# EAGLE design Cab_Board (EAGLE 9.6.2)
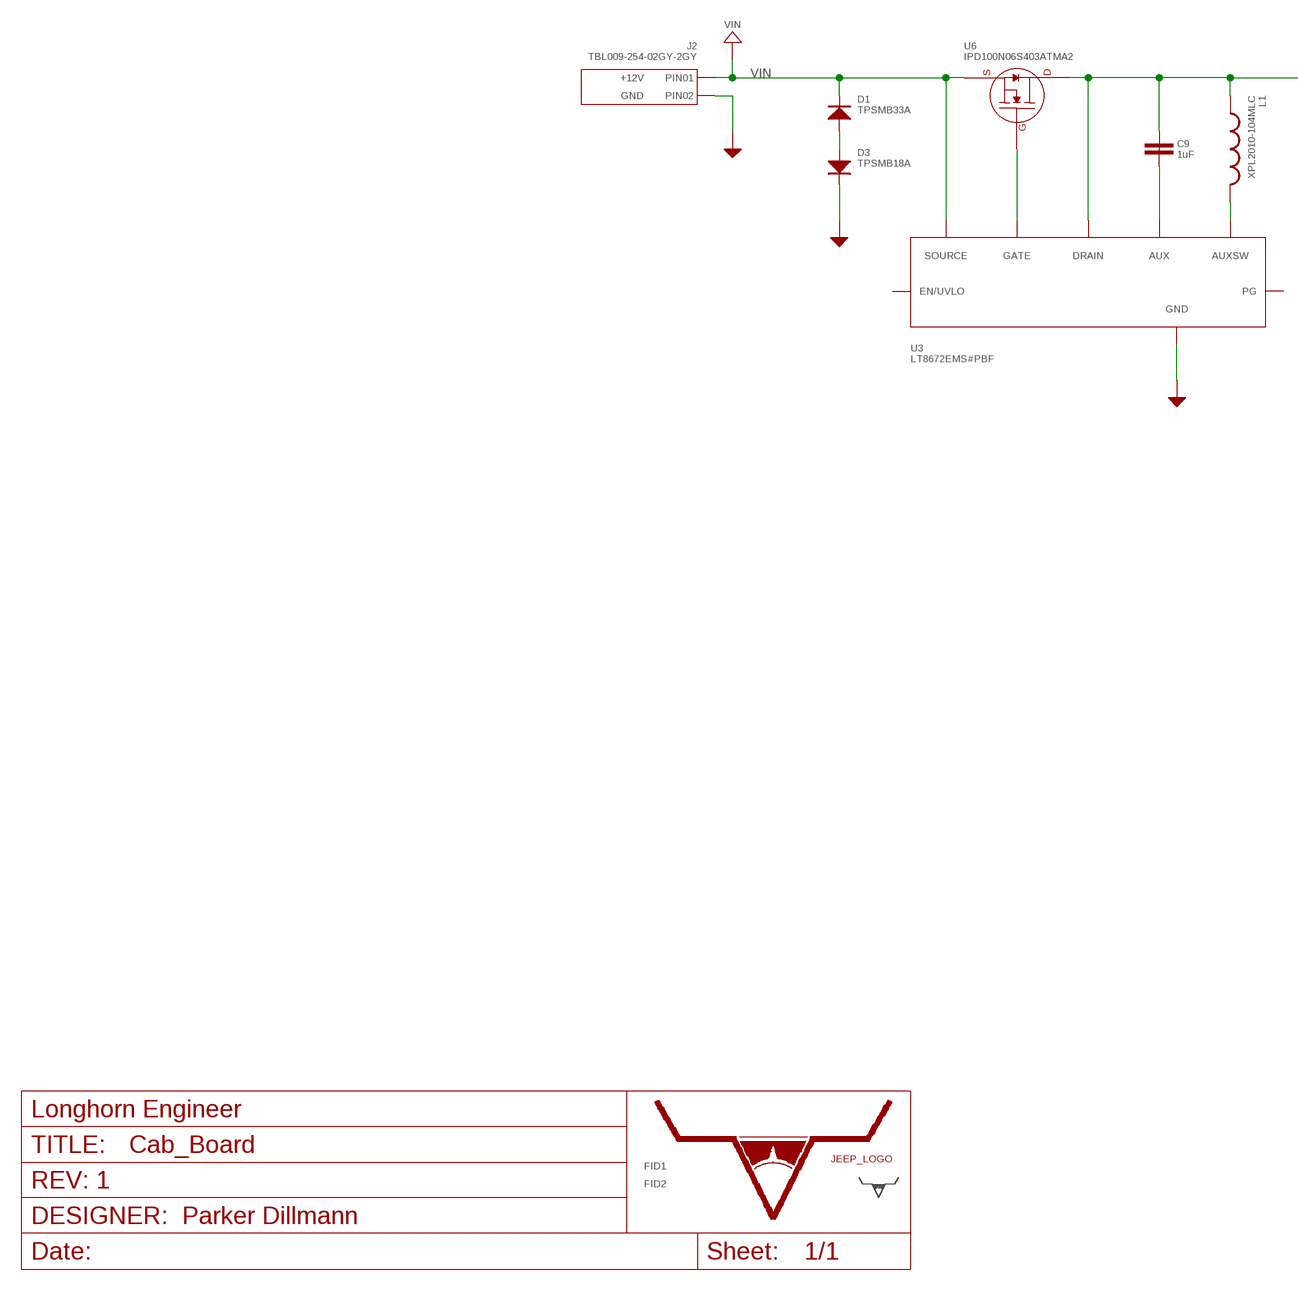
[diagram p0: schematic, sheet 1, part 1 of 3]
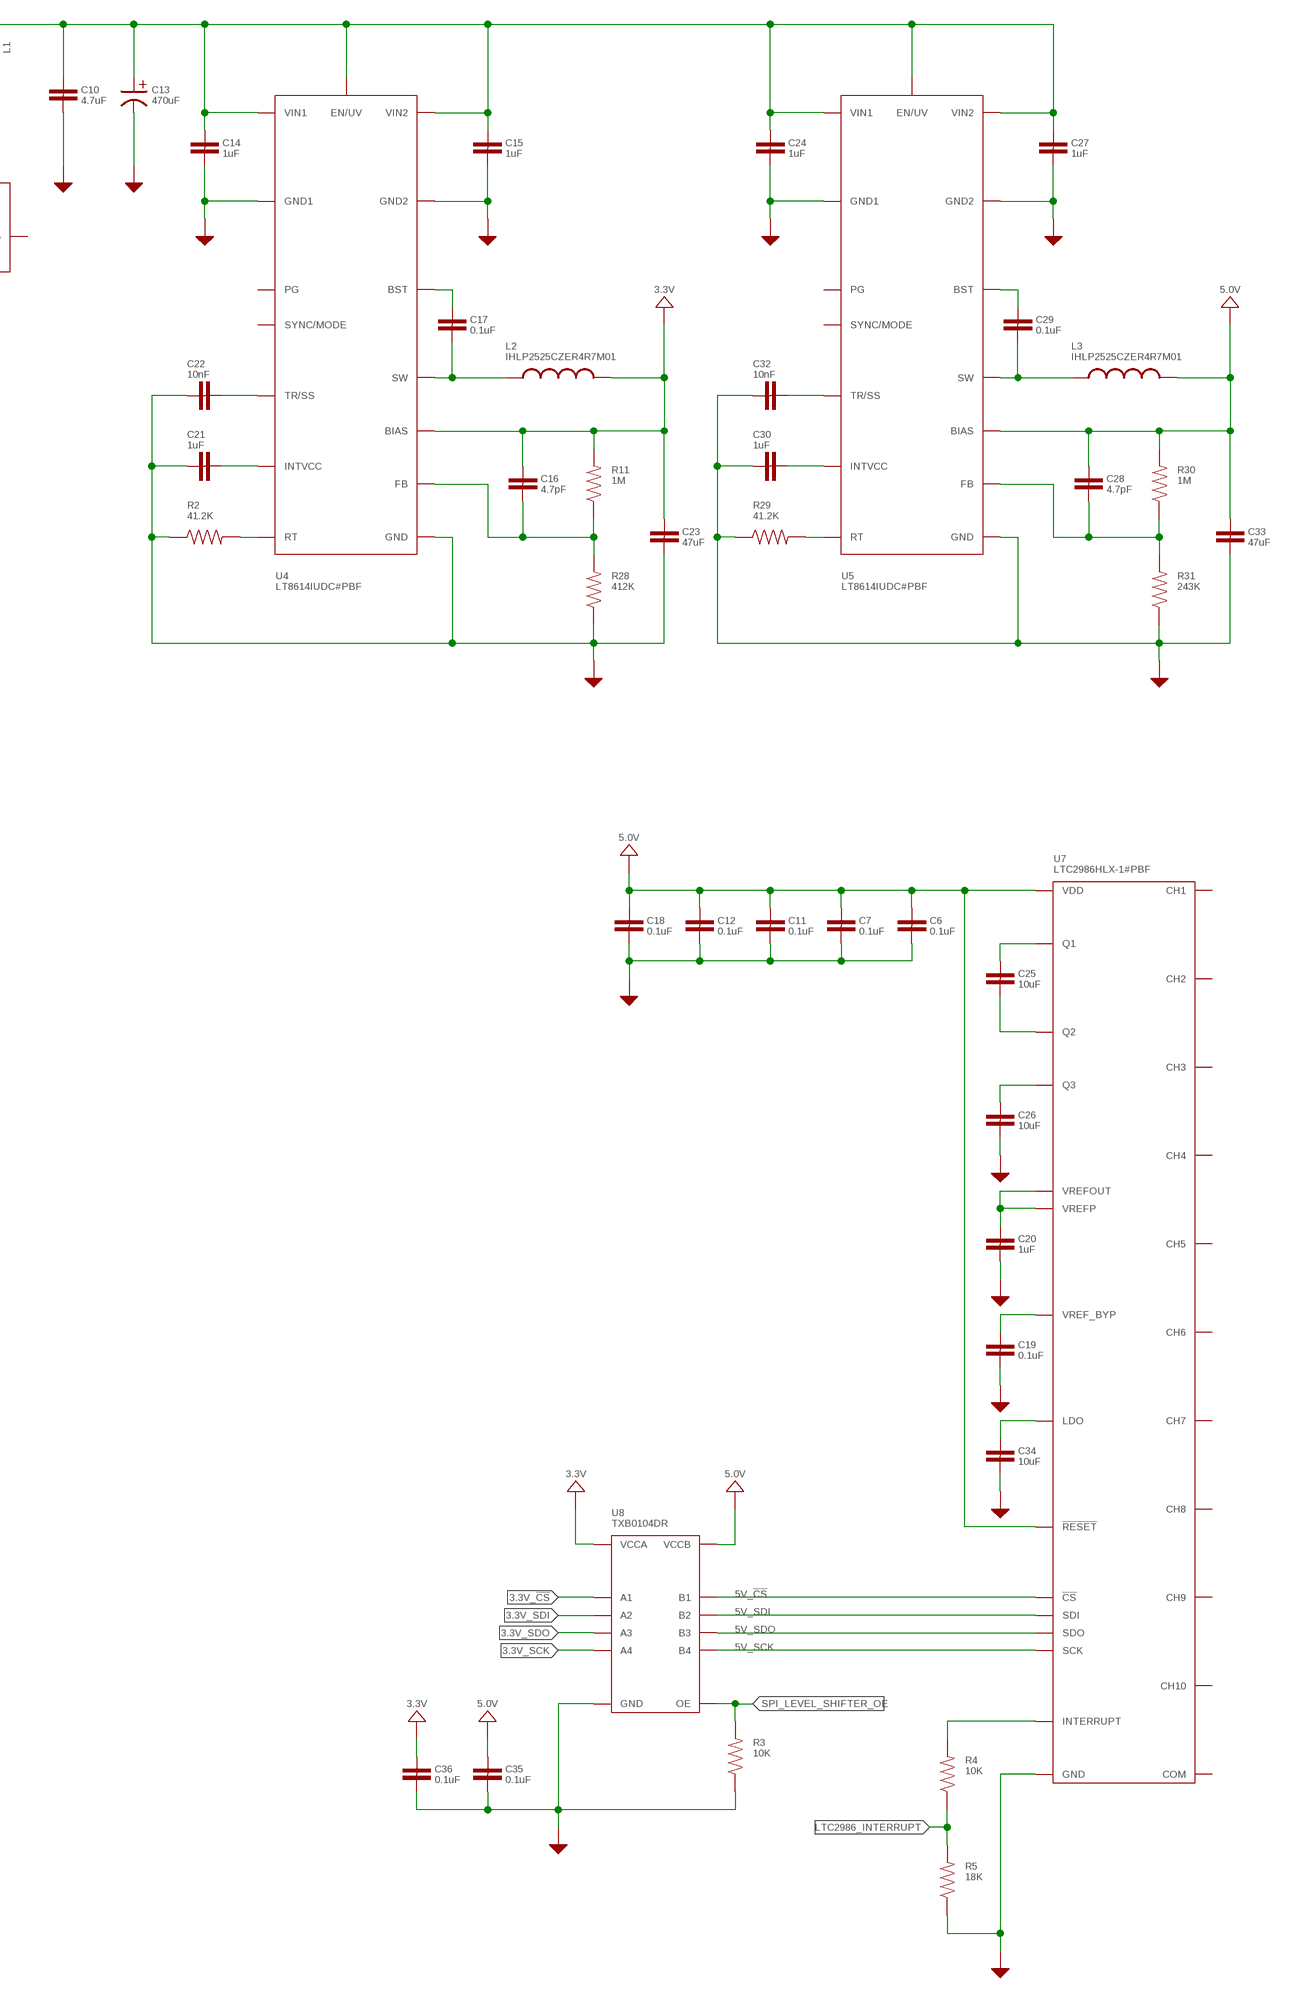
[diagram p1: schematic, sheet 1, part 2 of 3]
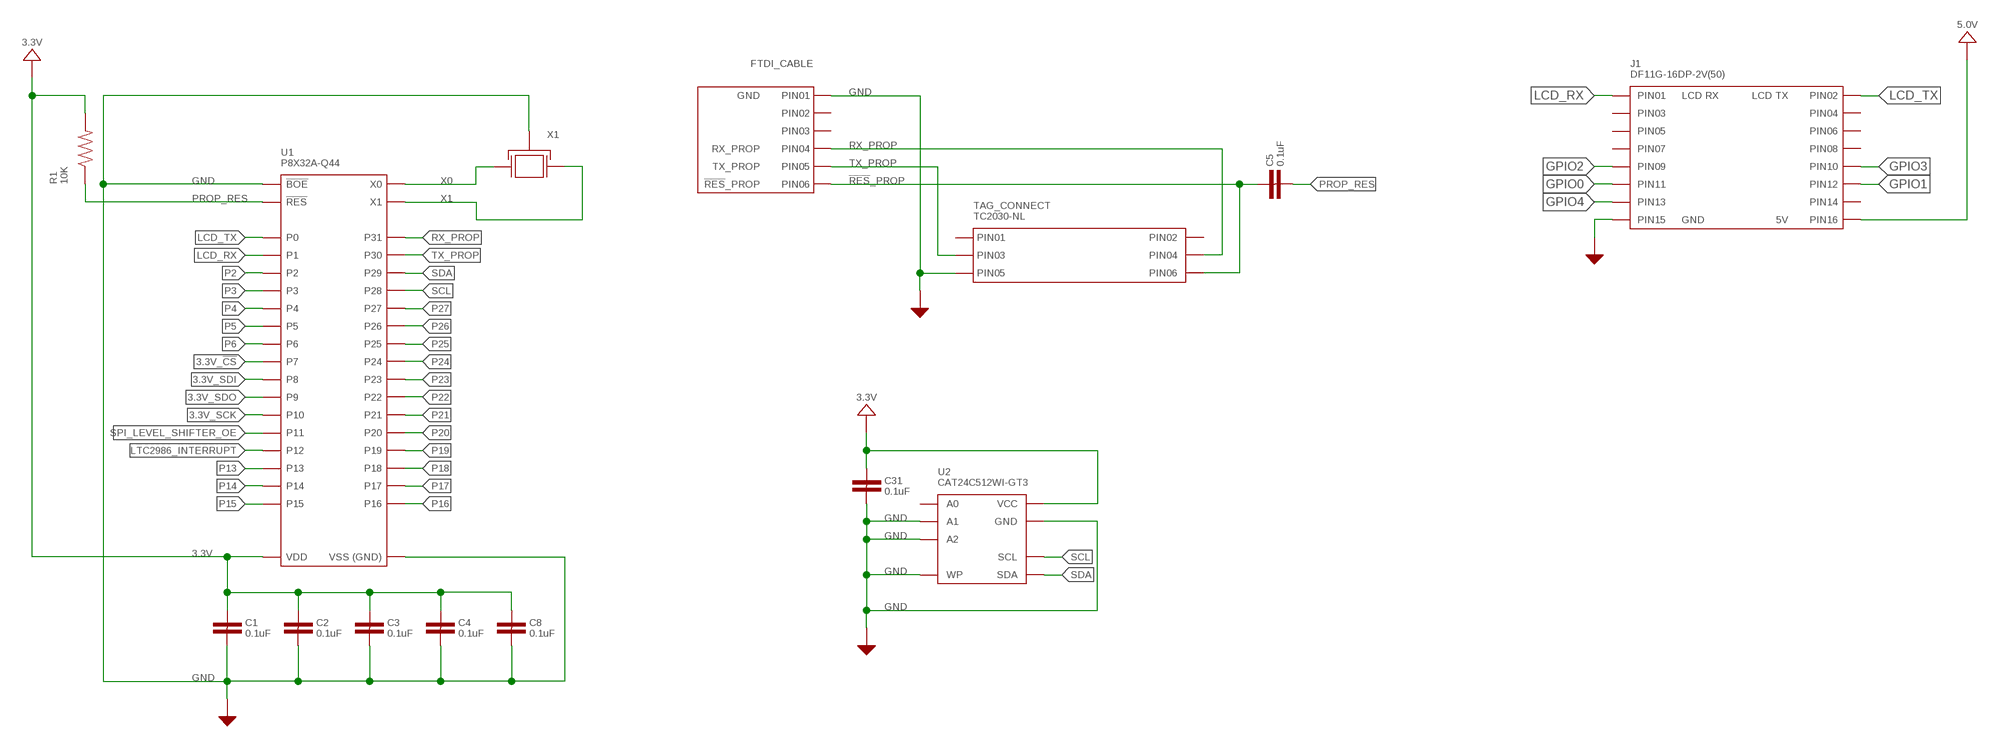
[diagram p2: schematic, sheet 1, part 3 of 3]

## Parts
C1  0.1uF  CAPACITOR_NON_POLAR_0805  [0805]
C2  0.1uF  CAPACITOR_NON_POLAR_0805  [0805]
C3  0.1uF  CAPACITOR_NON_POLAR_0805  [0805]
C4  0.1uF  CAPACITOR_NON_POLAR_0805  [0805]
C5  0.1uF  CAPACITOR_NON_POLAR_0603  [0603]
C6  0.1uF  CAPACITOR_NON_POLAR_0805  [0805]
C7  0.1uF  CAPACITOR_NON_POLAR_0805  [0805]
C8  0.1uF  CAPACITOR_NON_POLAR_0805  [0805]
C9  1uF  CAPACITOR_NON_POLAR_0805  [0805]
C10  4.7uF  CAPACITOR_NON_POLAR_1210  [1210]
C11  0.1uF  CAPACITOR_NON_POLAR_0805  [0805]
C12  0.1uF  CAPACITOR_NON_POLAR_0805  [0805]
C13  470uF  CAPACITOR_POLARIZED_10MM_SMD  [10MM_CAP_SMD]
C14  1uF  CAPACITOR_NON_POLAR_0805  [0805]
C15  1uF  CAPACITOR_NON_POLAR_0805  [0805]
C16  4.7pF  CAPACITOR_NON_POLAR_0603  [0603]
C17  0.1uF  CAPACITOR_NON_POLAR_0603  [0603]
C18  0.1uF  CAPACITOR_NON_POLAR_0805  [0805]
C19  0.1uF  CAPACITOR_NON_POLAR_0805  [0805]
C20  1uF  CAPACITOR_NON_POLAR_0805  [0805]
C21  1uF  CAPACITOR_NON_POLAR_0805  [0805]
C22  10nF  CAPACITOR_NON_POLAR_0603  [0603]
C23  47uF  CAPACITOR_NON_POLAR_1210  [1210]
C24  1uF  CAPACITOR_NON_POLAR_0805  [0805]
C25  10uF  CAPACITOR_NON_POLAR_1210  [1210]
C26  10uF  CAPACITOR_NON_POLAR_1210  [1210]
C27  1uF  CAPACITOR_NON_POLAR_0805  [0805]
C28  4.7pF  CAPACITOR_NON_POLAR_0603  [0603]
C29  0.1uF  CAPACITOR_NON_POLAR_0603  [0603]
C30  1uF  CAPACITOR_NON_POLAR_0805  [0805]
C31  0.1uF  CAPACITOR_NON_POLAR_0805  [0805]
C32  10nF  CAPACITOR_NON_POLAR_0603  [0603]
C33  47uF  CAPACITOR_NON_POLAR_1210  [1210]
C34  10uF  CAPACITOR_NON_POLAR_1210  [1210]
C35  0.1uF  CAPACITOR_NON_POLAR_0805  [0805]
C36  0.1uF  CAPACITOR_NON_POLAR_0805  [0805]
D1  TPSMB33A  DIODE_DO-214AA  [DO-214AA]
D3  TPSMB18A  DIODE_DO-214AA  [DO-214AA]
FID1  FIDUCIAL_0.5MM  [FIDUCIAL_0.5MM]
FID2  FIDUCIAL_0.5MM  [FIDUCIAL_0.5MM]
FTDI_CABLE  CON_01X06_2.54MM_PIN_HEADER  [2.54MM_01X06_PIN_HEADER]
J1  DF11G-16DP-2V(50)  CON_02X08_DF11G-16DP-2V(50)  [DF11G-16DP-2V(50)]
J2  TBL009-254-02GY-2GY  CON_01X02_TBL009-254-02GY-2GY  [TBL009-254-02GY-2GY]
L1  XPL2010-104MLC  INDUCTOR_XPL2010  [XPL2010]
L2  IHLP2525CZER4R7M01  INDUCTOR_IHLP-2525  [IHLP-2525]
L3  IHLP2525CZER4R7M01  INDUCTOR_IHLP-2525  [IHLP-2525]
R1  10K  RESISTOR_0805  [0805]
R2  41.2K  RESISTOR_0603  [0603]
R3  10K  RESISTOR_0603  [0603]
R4  10K  RESISTOR_0603  [0603]
R5  18K  RESISTOR_0603  [0603]
R11  1M  RESISTOR_0603  [0603]
R28  412K  RESISTOR_0603  [0603]
R29  41.2K  RESISTOR_0603  [0603]
R30  1M  RESISTOR_0603  [0603]
R31  243K  RESISTOR_0603  [0603]
TAG_CONNECT  TC2030-NL  CON_02X03_TC2030  [TC2030]
U1  P8X32A-Q44  [LQFP44]
U2  CAT24C512WI-GT3  EEPROM_I2CSOIC-8_W  [SOIC-8_W]
U3  LT8672EMS#PBF  [LT8672_MSOP-10]
U4  LT8614IUDC#PBF  [LT8614_QFN-18]
U5  LT8614IUDC#PBF  [LT8614_QFN-18]
U6  IPD100N06S403ATMA2  MOSFET_N-CHANNEL_SINGLE_TO-252-3  [TO-252-3]
U7  LTC2986HLX-1#PBF  LTC2986HLX#PBF  [LQFP-48]
U8  TXB0104DR  [TXB0104_SOIC-14]
U$1  LHE_FRAME  [LHE_FRAME]
U$35  JEEP_LOGO_SILK_MEDIUM  [JEEP_SILK_MEDIUM]
U$42  LHE_LOGOLHE_LOGO  [LHE_LOGO]
X1  6.0MHz  CYRSTAL_GND_ABMM  [7MMX5MM]

## Nets
3.3V: C1.1 C2.1 C3.1 C4.1 C8.1 C16.1 C23.1 C31.1 C36.1 L2.P$2 R1.2 R11.2 U1.8(VDD) U1.18(VDD) U1.30(VDD) U1.40(VDD) U2.8(VCC) U4.1(BIAS) U8.1(VCCA)
3.3V_!CS: U1.4(P7) U8.2(A1)
3.3V_SCK: U1.11(P10) U8.5(A4)
3.3V_SDI: U1.9(P8) U8.3(A2)
3.3V_SDO: U1.10(P9) U8.4(A3)
5.0V: C6.1 C7.1 C11.1 C12.1 C18.1 C28.1 C33.1 C35.1 J1.P$16 L3.P$2 R30.2 U5.1(BIAS) U7.P$2(VDD) U7.P$4(VDD) U7.P$6(VDD) U7.P$8(VDD) U7.P$42(!RESET) U7.P$45(VDD) U8.14(VCCB)
5V_!CS: U7.P$41(!CS) U8.13(B1)
5V_SCK: U7.P$38(SCK) U8.10(B4)
5V_SDI: U7.P$40(SDI) U8.12(B2)
5V_SDO: U7.P$39(SDO) U8.11(B3)
!RES!_PROP: C5.1 FTDI_CABLE.6 TAG_CONNECT.P$6(PIN6)
BST: C17.1 U4.3(BST)
BST1: C29.1 U5.3(BST)
FB: C16.2 R11.1 R28.2 U4.20(FB)
FB1: C28.2 R30.1 R31.2 U5.20(FB)
GND: C1.2 C2.2 C3.2 C4.2 C6.2 C7.2 C8.2 C10.2 C11.2 C12.2 C13.NEG C14.2 C15.2 C18.2 C19.2 C20.2 C21.1 C22.1 C23.2 C24.2 C26.2 C27.2 C30.1 C31.2 C32.1 C33.2 C34.2 C35.2 C36.2 D3.C(CATHODE) FTDI_CABLE.1 J1.P$15 J2.2A(PIN2) J2.2B(PIN2) R2.1 R3.1 R5.1 R28.1 R29.1 R31.1 TAG_CONNECT.P$5(PIN5) U1.5(VSS) U1.6(BOE') U1.17(VSS) U1.27(VSS) U1.39(VSS) U2.2(A1) U2.3(A2) U2.4(GND) U2.7(WP) U3.2(GND) U3.4(GND) U4.6(GND1) U4.7(GND1) U4.10(GND2) U4.11(GND2) U4.18(GND) U5.6(GND1) U5.7(GND1) U5.10(GND2) U5.11(GND2) U5.18(GND) U7.P$1(GND) U7.P$3(GND) U7.P$5(GND) U7.P$7(GND) U7.P$9(GND) U7.P$12(GND) U7.P$15(GND) U7.P$26(GND) U7.P$27(GND) U7.P$28(GND) U7.P$29(GND) U7.P$30(GND) U7.P$31(GND) U7.P$32(GND) U7.P$33(GND) U7.P$34(GND) U7.P$35(GND) U7.P$44(GND) U8.7(GND) X1.P$2(GND) X1.P$4(GND)
GPIO0: J1.P$11
GPIO1: J1.P$12
GPIO2: J1.P$9
GPIO3: J1.P$10
GPIO4: J1.P$13
INTVCC: C21.2 U4.2(INTVCC)
INTVCC1: C30.2 U5.2(INTVCC)
LCD_RX: J1.P$1 U1.42(P1)
LCD_TX: J1.P$2 U1.41(P0)
LTC2986_INTERRUPT: R4.1 R5.2 U1.13(P12)
N$1: C19.1 U7.P$11(VREF_BYP)
N$2: U3.10(GATE) U6.1(GATE)
N$3: C20.1 U7.P$13(VREFOUT) U7.P$14(VREFP)
N$4: C26.1 U7.P$46(Q3)
N$6: C25.2 U7.P$47(Q2)
N$7: C25.1 U7.P$48(Q1)
N$8: C34.1 U7.P$43(LDO)
N$9: D1.A(ANODE) D3.A(ANODE)
N$12: R4.2 U7.P$37(INTERRUPT)
N$13: C9.1 C10.1 C13.POS C14.1 C15.1 C24.1 C27.1 L1.P$1 U3.8(DRAIN) U4.4(VIN1) U4.13(VIN2) U4.14(EN/UV) U5.4(VIN1) U5.13(VIN2) U5.14(EN/UV) U6.PAD(DRAIN)
N$14: C9.2 U3.7(AUX)
N$15: L1.P$2 U3.6(AUXSW)
P2: U1.43(P2)
P3: U1.44(P3)
P4: U1.1(P4)
P5: U1.2(P5)
P6: U1.3(P6)
P13: U1.14(P13)
P14: U1.15(P14)
P15: U1.16(P15)
P16: U1.19(P16)
P17: U1.20(P17)
P18: U1.21(P18)
P19: U1.22(P19)
P20: U1.23(P20)
P21: U1.24(P21)
P22: U1.25(P22)
P23: U1.26(P23)
P24: U1.31(P24)
P25: U1.32(P25)
P26: U1.33(P26)
P27: U1.34(P27)
PROP_RES: C5.2 R1.1 U1.7(RES')
RT: R2.2 U4.15(RT)
RT1: R29.2 U5.15(RT)
RX_PROP: FTDI_CABLE.4 TAG_CONNECT.P$4(PIN4) U1.38(P31)
SCL: U1.35(P28) U2.6(SCL)
SDA: U1.36(P29) U2.5(SDA)
SPI_LEVEL_SHIFTER_OE: R3.2 U1.12(P11) U8.8(OE)
SW: C17.2 L2.P$1 U4.8(SW) U4.9(SW) U4.21(SW) U4.22(SW)
SW1: C29.2 L3.P$1 U5.8(SW) U5.9(SW) U5.21(SW) U5.22(SW)
TR/SS: C22.2 U4.16(TR/SS)
TR/SS1: C32.2 U5.16(TR/SS)
TX_PROP: FTDI_CABLE.5 TAG_CONNECT.P$3(PIN3) U1.37(P30)
VIN: D1.C(CATHODE) J2.1A(PIN1) J2.1B(PIN1) U3.9(SOURCE) U6.3(SOURCE)
X0: U1.29(X0) X1.P$3(X1)
X1: U1.28(X1) X1.P$1(X0)
Unconnected: FTDI_CABLE.2 FTDI_CABLE.3 J1.P$3 J1.P$4 J1.P$5 J1.P$6 J1.P$7 J1.P$8 J1.P$14 TAG_CONNECT.P$1(PIN1) TAG_CONNECT.P$2(PIN2) U2.1(A0) U3.1(EN/UVLO) U3.3(PG) U4.17(SYNC/MODE) U4.19(PG) U5.17(SYNC/MODE) U5.19(PG) U7.P$16(CH1) U7.P$17(CH2) U7.P$18(CH3) U7.P$19(CH4) U7.P$20(CH5) U7.P$21(CH6) U7.P$22(CH7) U7.P$23(CH8) U7.P$24(CH9) U7.P$25(CH10) U7.P$36(COM)

## Library data of the parts
C1-C8 C11 C12 C18 C19 C35 C36 = PP_Passives:CAPACITOR_NON_POLAR: Capacitor Non Polarized; MPN: MF-CAP-0805-0.1uF
C9 C14 C15 C21 C24 C27 C30 = PP_Passives:CAPACITOR_NON_POLAR: Capacitor Non Polarized; MPN: C0805X105K5RACAUTO
C10 = PP_Passives:CAPACITOR_NON_POLAR: Capacitor Non Polarized; MPN: UMJ325AB7475KMHP
C13 = PP_Passives:CAPACITOR_POLARIZED: Polarized capacitors; MPN: EEH-ZS1V471P
C16 C28 = PP_Passives:CAPACITOR_NON_POLAR: Capacitor Non Polarized; MPN: C0603C479D5HACTU
C17 C29 = PP_Passives:CAPACITOR_NON_POLAR: Capacitor Non Polarized; MPN: MF-CAP-0603-0.1uF
C20 = PP_Passives:CAPACITOR_NON_POLAR: Capacitor Non Polarized; MPN: MF-CAP-0805-1uF
C22 C32 = PP_Passives:CAPACITOR_NON_POLAR: Capacitor Non Polarized; MPN: C0603X103K5RAC3316
C23 C33 = PP_Passives:CAPACITOR_NON_POLAR: Capacitor Non Polarized; MPN: GCJ32ER70J476KE01L
C25 C26 C34 = PP_Passives:CAPACITOR_NON_POLAR: Capacitor Non Polarized; MPN: CGA6P1X7R1N106K250AC
C31 = PP_Passives:CAPACITOR_NON_POLAR: Capacitor Non Polarized; MPN: MF-CAP-0805-0.1uF; SPICEPREFIX: C
D1 = PP_Passives:DIODE: Diode - Single; MPN: TPSMB33A
D3 = PP_Passives:DIODE: Diode - Single; MPN: TPSMB18A
FID1 FID2 = MF_Aesthetics:FIDUCIAL: Library: MF_Aesthetics Description: Fiducial marking for PCB alignment inside PNP and other machines.; HOUSEPART: NO; POPULATE: 0
FTDI_CABLE = PP_Connectors:CON_01X06: 6 pin connectors; LABEL01: GND; LABEL04: RX_PROP; LABEL05: TX_PROP; LABEL06: !RES!_PROP; POPULATE: 1
J1 = PP_Connectors:CON_02X08; LABEL01: LCD RX; LABEL02: LCD TX; LABEL15: GND; LABEL16: 5V; MPN: DF11G-16DP-2V(50); POPULATE: 1
J2 = PP_Connectors:CON_01X02; LABEL01: +12V; LABEL02: GND; MPN: TBL009-254-02GY-2GY
L1 = PP_Passives:INDUCTOR: Inductors; MPN: XPL2010-104MLC
L2 L3 = PP_Passives:INDUCTOR: Inductors; MPN: IHLP2525CZER4R7M01
R1 R2 R5 R11 R28-R31 = PP_Passives:RESISTOR: Resistors
R3 R4 = PP_Passives:RESISTOR: Resistors; MPN: MF-RES-0603-10K
TAG_CONNECT = PP_Connectors:CON_02X03; POPULATE: 0
U1 = MF_IC_Digital:P8X32A: Manufacturer Part #: P8X32A Manufacturer: Parallax Description: 32-bit Microcontrollers - MCU LQFP pkg Propeller Chip; HOUSEPART: NO; MPN: P8X32A-Q44; POPULATE: 1; URL: https://www.parallax.com/sites/default/files/downloads/P8X32A-Propeller-Datasheet-v1.4.0_0.pdf
U2 = PP_DigitalIC:EEPROM_I2C; MPN: CAT24C512WI-GT3; SPICEPREFIX: X
U3 = PP_PowerIC:LT8672; MPN: LT8672EMS#PBF
U4 U5 = PP_PowerIC:LT8614; MPN: LT8614IUDC#PBF
U6 = PP_DiscreteSemi:MOSFET_N-CHANNEL_SINGLE: Mosfet - N-Channel - Single; MPN: IPD100N06S403ATMA2
U7 = PP_Sensors:LTC2986HLX; MPN: LTC2986HLX-1#PBF; POPULATE: 1
U8 = PP_DigitalIC:TXB0104; MPN: TXB0104DR; POPULATE: 1
U$1 = PP_Aesthetics:LHE_FRAME; DNAME: Parker Dillmann; REVNUM: REV: 1
U$35 = PP_Aesthetics:JEEP_LOGO
U$42 = PP_Aesthetics:LHE_LOGO
X1 = MF_Frequency_Control:CYRSTAL_GND: Library: MF_Frequency_Control Description: Device for two functional pin Cyrstal Oscillators and a ground.; HOUSEPART: NO; MPN: ABMM-6.000MHZ-B2-T; POPULATE: 1; URL: http://www.abracon.com/Resonators/ABMM.pdf

## Board
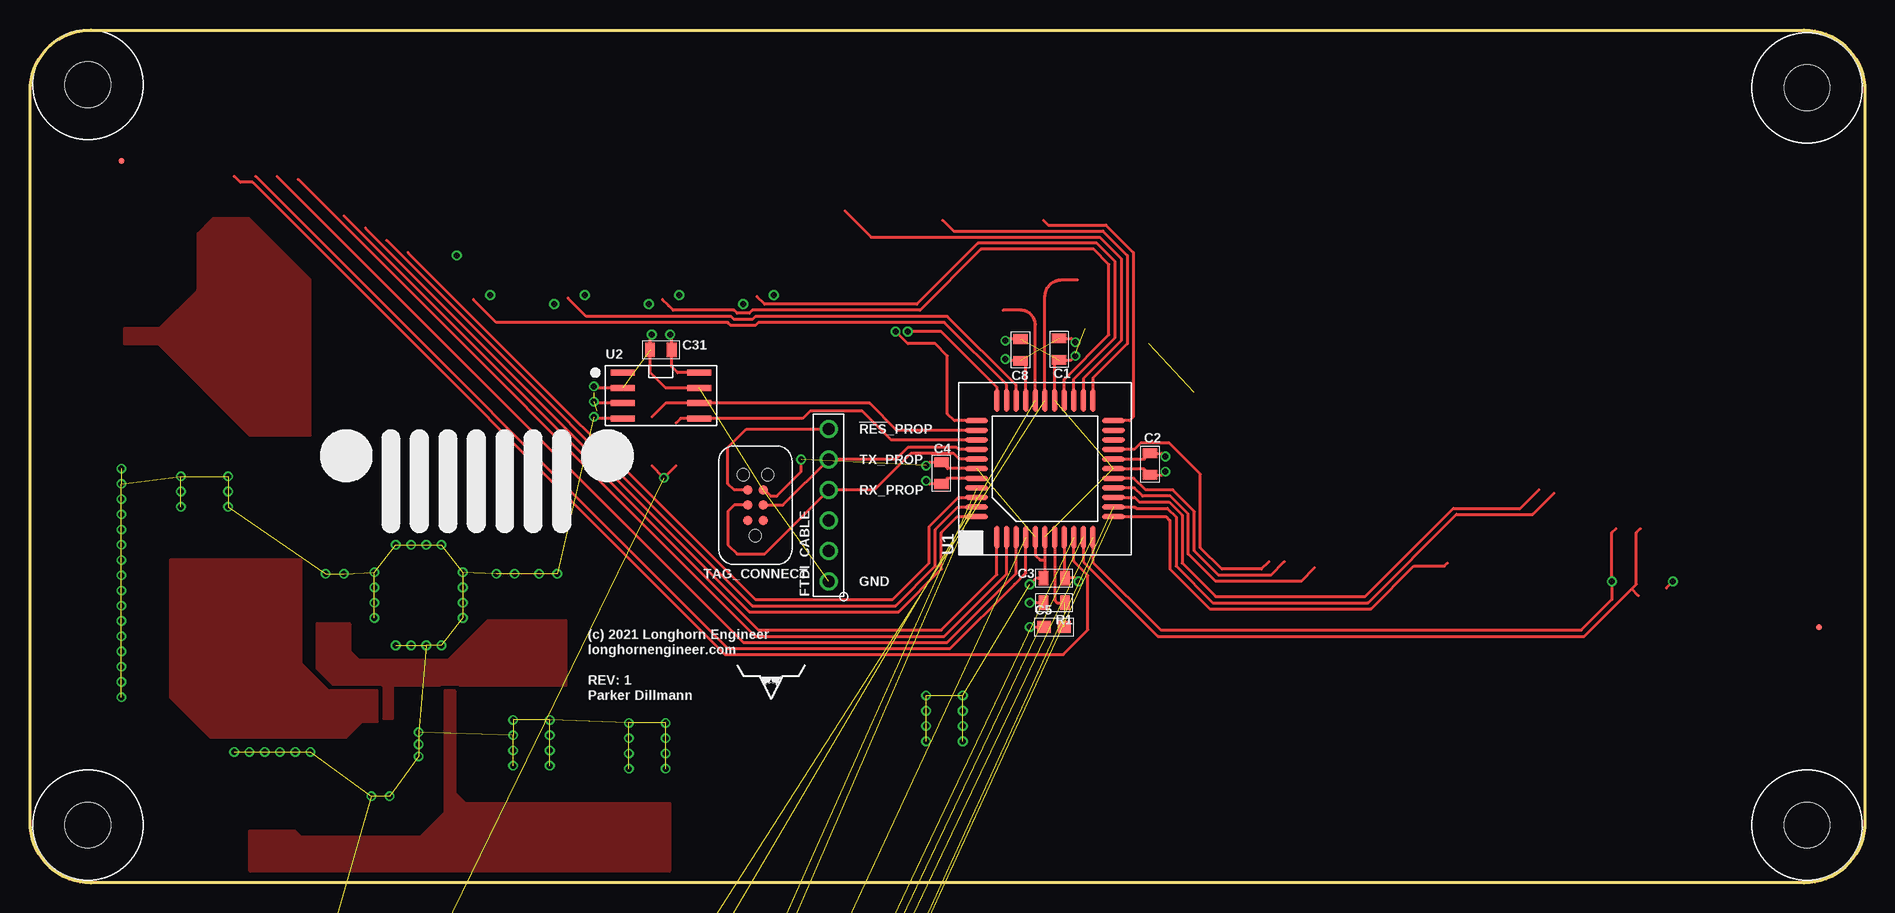
[diagram p3: board, top side]
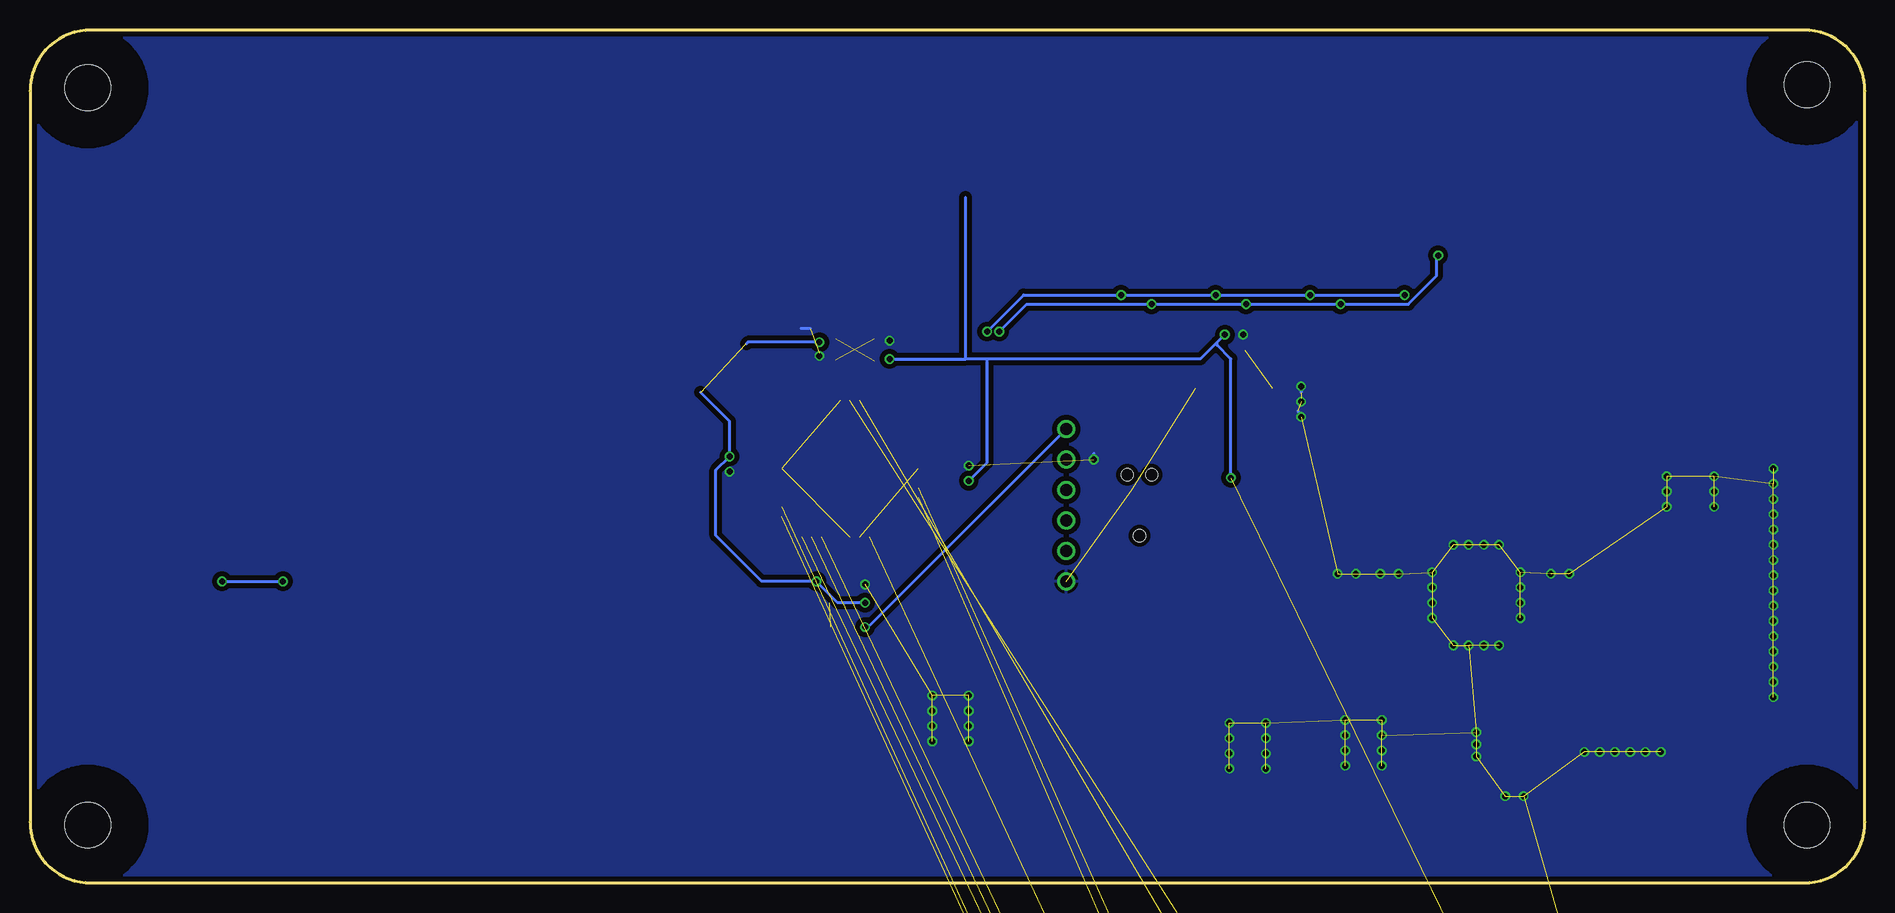
[diagram p4: board, bottom side, seen from below]

Size 152.91 x 71.12 mm. Coordinates in mm from the lower left corner, seen from the top.
Outline: 0,5.08 0,66.04 arc-90 5.08,71.12 147.83,71.12 arc-90 152.91,66.04 152.91,5.08 arc-90 147.83,0 5.08,0 arc-90 0,5.08
Copper layers (1*16): Top 0.035mm / dielectric 1.5mm / Bottom 0.035mm
Design rules "MF_Standard_2_Layer": minimum track width 6mil, minimum drill 12mil, track to track 6mil, track to pad 6mil, pad to pad 6mil, via to via 6mil, smd to smd 0mil, copper to edge 10mil, drill to drill 10mil, minimum pad ring 6mil, minimum via ring 6mil, stop-mask expansion 2mil, vias tented up to drill 25mil, thermal gap 10mil

### Footprints (pad centres in the part's own frame; a part is rotated, then mirrored left to right if it is on the bottom)
0805 = smd 0.8 x 1.2: 1 -0.9,0; 2 0.9,0
0603 = smd 1.1 x 1: 1 -0.85,0; 2 0.85,0
1210 = smd 1.6 x 2.6: 1 -1.4,0; 2 1.4,0
10MM_CAP_SMD = smd 1.1 x 4: NEG 0,-3.88; POS 0,3.88
DO-214AA = smd 2.159 x 2.743: A 2.21,0; C -2.21,0
FIDUCIAL_0.5MM = smd 0.5 x 0.5: FID 0,0
2.54MM_01X06_PIN_HEADER = drill 1: 1 -6.35,0; 2 -3.81,0; 3 -1.27,0; 4 1.27,0; 5 3.81,0; 6 6.35,0
DF11G-16DP-2V(50) = smd 1.1 x 2: P$1 7,-4.15; P$2 7,4.15; P$3 5,-4.15; P$4 5,4.15; P$5 3,-4.15; P$6 3,4.15; P$7 1,-4.15; P$8 1,4.15; P$9 -1,-4.15; P$10 -1,4.15; P$11 -3,-4.15; P$12 -3,4.15; P$13 -5,-4.15; P$14 -5,4.15; P$15 -7,-4.15; P$16 -7,4.15 | smd 2 x 2.8: P$17 -11.35,0; P$18 11.35,0
TBL009-254-02GY-2GY = drill 1: 1A 0,0; 1B 0,5.08; 2A 2.54,0; 2B 2.54,5.08
XPL2010 = smd 0.6 x 1.8: P$1 -0.675,0; P$2 0.675,0
IHLP-2525 = smd 2.413 x 3.429: P$1 -2.921,0; P$2 2.921,0
TC2030 = smd 0.787 x 0.787: P$1 -1.27,-0.635; P$2 -1.27,0.635; P$3 0,-0.635; P$4 0,0.635; P$5 1.27,-0.635; P$6 1.27,0.635 | hole 0.991: 2.54,1.016; 2.54,-1.016; -2.54,0
LQFP44 = smd 1.9 x 0.4: 1 -5.7,4; 2 -5.7,3.2; 3 -5.7,2.4; 4 -5.7,1.6; 5 -5.7,0.8; 6 -5.7,0; 7 -5.7,-0.8; 8 -5.7,-1.6; 9 -5.7,-2.4; 10 -5.7,-3.2; 11 -5.7,-4; 23 5.7,-4; 24 5.7,-3.2; 25 5.7,-2.4; 26 5.7,-1.6; 27 5.7,-0.8; 28 5.7,0; 29 5.7,0.8; 30 5.7,1.6; 31 5.7,2.4; 32 5.7,3.2; 33 5.7,4 | smd 0.4 x 1.9: 12 -4,-5.7; 13 -3.2,-5.7; 14 -2.4,-5.7; 15 -1.6,-5.7; 16 -0.8,-5.7; 17 0,-5.7; 18 0.8,-5.7; 19 1.6,-5.7; 20 2.4,-5.7; 21 3.2,-5.7; 22 4,-5.7; 34 4,5.7; 35 3.2,5.7; 36 2.4,5.7; 37 1.6,5.7; 38 0.8,5.7; 39 0,5.7; 40 -0.8,5.7; 41 -1.6,5.7; 42 -2.4,5.7; 43 -3.2,5.7; 44 -4,5.7
SOIC-8_W = smd 2 x 0.5: 1 -3.185,1.905; 2 -3.185,0.635; 3 -3.185,-0.635; 4 -3.185,-1.905; 5 3.185,-1.905; 6 3.185,-0.635; 7 3.185,0.635; 8 3.185,1.905
LT8672_MSOP-10 = smd 0.305 x 0.889: 1 -1,-2.209; 2 -0.5,-2.209; 3 0,-2.209; 4 0.5,-2.209; 5 1,-2.209; 6 1,2.209; 7 0.5,2.209; 8 0,2.209; 9 -0.5,2.209; 10 -1,2.209
LT8614_QFN-18 = smd 0.7 x 0.25: 1 -1.4,1.25; 2 -1.4,0.75; 3 -1.4,0.25; 4 -1.4,-0.25; 6 -1.4,-1.25; 11 1.4,-1.25; 13 1.4,-0.25; 14 1.4,0.25; 15 1.4,0.75; 16 1.4,1.25 | smd 0.25 x 0.7: 7 -0.75,-1.9; 8 -0.25,-1.9; 9 0.25,-1.9; 10 0.75,-1.9; 17 0.75,1.9; 18 0.25,1.9; 19 -0.25,1.9; 20 -0.75,1.9 | smd 0.22 x 0.4: 21 0,-1.075 | smd 0.22 x 0.356: 22 0,-0.305
TO-252-3 = smd 1.2 x 2.2: 1 -2.28,-4.6; 3 2.28,-4.6 | smd 5.8 x 6.4: PAD 0,1.7
LQFP-48 = smd 1.3 x 0.25: P$1 -4.25,2.75; P$2 -4.25,2.25; P$3 -4.25,1.75; P$4 -4.25,1.25; P$5 -4.25,0.75; P$6 -4.25,0.25; P$7 -4.25,-0.25; P$8 -4.25,-0.75; P$9 -4.25,-1.25; P$10 -4.25,-1.75; P$11 -4.25,-2.25; P$12 -4.25,-2.75; P$25 4.25,-2.75; P$26 4.25,-2.25; P$27 4.25,-1.75; P$28 4.25,-1.25; P$29 4.25,-0.75; P$30 4.25,-0.25; P$31 4.25,0.25; P$32 4.25,0.75; P$33 4.25,1.25; P$34 4.25,1.75; P$35 4.25,2.25; P$36 4.25,2.75 | smd 0.25 x 1.3: P$13 -2.75,-4.25; P$14 -2.25,-4.25; P$15 -1.75,-4.25; P$16 -1.25,-4.25; P$17 -0.75,-4.25; P$18 -0.25,-4.25; P$19 0.25,-4.25; P$20 0.75,-4.25; P$21 1.25,-4.25; P$22 1.75,-4.25; P$23 2.25,-4.25; P$24 2.75,-4.25; P$37 2.75,4.25; P$38 2.25,4.25; P$39 1.75,4.25; P$40 1.25,4.25; P$41 0.75,4.25; P$42 0.25,4.25; P$43 -0.25,4.25; P$44 -0.75,4.25; P$45 -1.25,4.25; P$46 -1.75,4.25; P$47 -2.25,4.25; P$48 -2.75,4.25
TXB0104_SOIC-14 = smd 1.55 x 0.6: 1 -2.7,3.81; 2 -2.7,2.54; 3 -2.7,1.27; 4 -2.7,0; 5 -2.7,-1.27; 6 -2.7,-2.54; 7 -2.7,-3.81; 8 2.7,-3.81; 9 2.7,-2.54; 10 2.7,-1.27; 11 2.7,0; 12 2.7,1.27; 13 2.7,2.54; 14 2.7,3.81
MOUNT_HOLE_150MIL = hole 3.81: 0,0
7MMX5MM = smd 1.4 x 2.2: P$1 -1.27,3.15; P$2 1.27,3.15; P$3 1.27,-3.15 | smd 1.4 x 2.4: P$4 -1.27,-3.05

### Placement (x,y rotation side)
C1  85.77,44.51 270 top
C2  93.34,34.92 270 top
C3  85.34,25.4 180 top
C4  75.95,34.16 90 top
C5  85.34,21.34 0 top
C6  -59.18,-268.99 0 top  (outside the outline)
C7  -59.18,-272.29 0 top  (outside the outline)
C8  82.55,44.45 90 top
C9  -16.76,-133.1 0 top  (outside the outline)
C10  -15.75,-146.05 0 top  (outside the outline)
C11  -59.18,-275.59 0 top  (outside the outline)
C12  -59.18,-278.89 0 top  (outside the outline)
C13  -24.38,-141.48 0 top  (outside the outline)
C14  -33.27,-149.86 0 top  (outside the outline)
C15  -33.27,-153.16 0 top  (outside the outline)
C16  -33.27,-166.37 0 top  (outside the outline)
C17  -33.27,-169.67 0 top  (outside the outline)
C18  -59.18,-282.19 0 top  (outside the outline)
C19  -59.18,-285.5 0 top  (outside the outline)
C20  -59.18,-288.8 0 top  (outside the outline)
C21  -33.27,-172.97 0 top  (outside the outline)
C22  -33.27,-176.28 0 top  (outside the outline)
C23  -32.26,-180.34 0 top  (outside the outline)
C24  -35.81,-206.25 0 top  (outside the outline)
C25  -58.17,-292.86 0 top  (outside the outline)
C26  -58.17,-297.43 0 top  (outside the outline)
C27  -32,-206.25 0 top  (outside the outline)
C28  -29.97,-198.37 0 top  (outside the outline)
C29  -26.16,-198.37 0 top  (outside the outline)
C30  -28.19,-206.25 0 top  (outside the outline)
C31  52.58,44.45 180 top
C32  -35.81,-202.95 0 top  (outside the outline)
C33  -34.8,-199.14 0 top  (outside the outline)
C34  -58.17,-302.01 0 top  (outside the outline)
C35  -67.31,-309.12 0 top  (outside the outline)
C36  -67.31,-312.42 0 top  (outside the outline)
D1  -6.86,-122.94 0 top  (outside the outline)
D3  -6.6,-128.78 0 top  (outside the outline)
FID1  7.62,60.2 0 top
FID2  149.1,21.34 0 top
FTDI_CABLE  66.55,31.5 90 top
J1  -36.32,-213.36 0 top  (outside the outline)
J2  -41.66,-197.87 0 top  (outside the outline)
L1  -11.68,-141.99 0 top  (outside the outline)
L2  -33.78,-184.4 0 top  (outside the outline)
L3  -33.78,-192.79 0 top  (outside the outline)
R1  85.34,23.37 180 top
R2  -33.27,-156.46 0 top  (outside the outline)
R3  -67.31,-305.82 0 top  (outside the outline)
R4  -67.31,-315.72 0 top  (outside the outline)
R5  -67.31,-319.02 0 top  (outside the outline)
R11  -33.27,-159.77 0 top  (outside the outline)
R28  -33.27,-163.07 0 top  (outside the outline)
R29  -32,-202.95 0 top  (outside the outline)
R30  -28.19,-202.95 0 top  (outside the outline)
R31  -24.38,-202.95 0 top  (outside the outline)
TAG_CONNECT  60.45,31.5 90 top
U1  84.58,34.54 90 top
U2  52.58,40.64 0 top
U3  -9.4,-116.84 0 top  (outside the outline)
U4  -32.26,-145.03 0 top  (outside the outline)
U5  -26.42,-192.02 0 top  (outside the outline)
U6  -14.99,-124.46 0 top  (outside the outline)
U7  -54.86,-261.37 0 top  (outside the outline)
U8  -65.28,-298.96 0 top  (outside the outline)
U$1  46.48,15.24 0 top
U$31  [MOUNT_HOLE_150MIL]  4.83,4.83 0 top
U$32  [MOUNT_HOLE_150MIL]  4.83,66.55 0 top
U$33  [MOUNT_HOLE_150MIL]  148.08,66.29 0 top
U$34  [MOUNT_HOLE_150MIL]  148.08,4.83 0 top
U$35  23.62,28.45 0 top
U$42  63.75,15.24 0 top
X1  -3.56,-102.87 0 top  (outside the outline)

### Tracks (layer width: path | path; a pad name or v marks a point on that pad's centre or on a via)
3.3V  (via drill 0.5)  (9 unrouted)
  Top 0.254: U1.30 82.98,43.12 C8.1 81.42,43.55 v81.28,43.69 | U1.18 92.86,35.34 C2.1 94.35,35.83 v94.61,35.56 | U1.8 86.18,25.46 87.06,25.46 v87.38,25.15 | U1.40 76.43,33.74 C4.1 74.94,33.26 v74.68,33.53 | U2.8 53.98,42.55 53.48,43.04 C31.1 53.48,45.58 v53.34,45.72 | C1.1 86.8,45.41 v87.12,45.09 | 53.85,34.8 v52.83,33.78 51.82,34.8 | R1.2 v83.31,23.37
  Top 0.305: 86.18,25.46 arc90 C3.1
  Bottom 0.254: 97.03,40.89 94.61,38.48 v94.61,35.56 95.76,34.42 95.76,28.96 91.95,25.15 v87.38,25.15 85.6,23.37 v83.31,23.37 | v87.12,45.09 93.09,45.09 93.22,44.96 | 74.93,43.69 74.93,57.15 | v53.34,45.72 53.98,45.09 | 53.98,45.09 55.37,43.69 73.15,43.69 | 73.15,43.69 74.93,43.69 | v81.28,43.69 74.93,43.69 | v52.83,33.78 52.83,43.69 53.98,44.83 53.98,45.09 | v74.68,33.53 73.15,35.05 73.15,43.69
  pour Top (isolate 0.305, no thermals): 7.87,44.96 10.67,44.96 18.29,37.34 23.37,37.34 23.37,50.29 18.29,55.37 15.24,55.37 13.97,54.1 13.97,49.41 10.79,46.23 7.87,46.23
3.3V_!CS  (1 unrouted)
  Top 0.254: 18.8,58.93 58.17,19.56 76.71,19.56 82.04,24.89 82.98,25.83 U1.4
3.3V_SCK  (via drill 0.5)  (1 unrouted)
  Top 0.254: U1.11 88.58,26.73 94.23,21.08 129.29,21.08 131.83,23.62 v131.83,25.15 131.83,29.21 132.17,29.55 | 136.36,24.6 v136.91,25.15
  Bottom 0.254: v136.91,25.15 v131.83,25.15
3.3V_SDI  (1 unrouted)
  Top 0.254: 17.02,58.93 17.53,58.42 18.54,58.42 57.91,19.05 86.11,19.05 88.16,21.11 88.16,25.63 86.98,26.81 U1.9
3.3V_SDO  (1 unrouted)
  Top 0.254: U1.10 87.78,26.77 93.98,20.57 129.54,20.57 133.48,24.51 | 133.48,24.51 133.86,24.89 133.86,29.21 134.2,29.55 | 134.04,23.95 133.48,24.51
5.0V  (18 unrouted)
5V
  pour Top (isolate 0.305, no thermals): 34.54,16 34.54,5.84 32.51,3.81 22.61,3.81 22.1,4.32 18.29,4.32 18.29,1.02 53.34,1.02 53.34,6.6 36.32,6.6 35.43,7.49 35.43,16
5V_!CS  (1 unrouted)
5V_SCK  (1 unrouted)
5V_SDI  (1 unrouted)
5V_SDO  (1 unrouted)
12V
  pour Top (isolate 0.305, rank 2, no thermals): 23.88,21.59 23.88,17.78 25.15,16.51 29.46,16.51 29.46,13.72 30.23,13.72 30.23,16.51 44.7,16.51 44.7,21.84 38.1,21.84 34.8,18.54 27.43,18.54 26.67,19.3 26.67,21.59
!RES!_PROP  (via drill 0.5)
  Top 0.254: TAG_CONNECT.P$6 58.67,32.77 58.17,33.27 58.17,36.32 59.69,37.85 FTDI_CABLE.6 | v83.31,21.34 C5.1
  Bottom 0.254: FTDI_CABLE.6 83.06,21.34 v83.31,21.34
BST  (1 unrouted)
BST1  (1 unrouted)
FB  (3 unrouted)
FB1  (3 unrouted)
GND  (via drill 0.5)  (156 unrouted)
  Top 0.254: U1.27 85.38,43.22 arc-90 C1.2 86.79,43.61 v87.12,43.94 | U1.17 92.83,34.54 C2.2 94.35,34.02 v94.61,34.29 | U1.6 84.58,26.92 | 84.58,26.92 84.58,25.54 C3.2 83.82,25.4 v83.31,24.89 | U1.5 83.78,27.31 84.17,26.92 84.58,26.92 | U1.39 76.47,34.54 C4.2 74.94,35.06 v74.68,34.8 | U2.7 52.96,41.27 51.68,42.56 C31.2 51.68,45.58 v51.82,45.72 | U2.3 47.12,40.01 v46.99,40.13 | U2.2 47.12,41.27 v46.99,41.4 | U2.4 47.12,38.73 v46.99,38.86 | C8.2 81.42,45.35 v81.28,45.21 | TAG_CONNECT.P$5 61.21,32.77 61.72,32.26 62.23,32.26 64.26,34.29 v64.26,35.31
  Bottom 0.254: v46.99,40.13 46.99,40.39 | v46.99,41.4 46.99,40.89 | v46.99,38.86 46.99,39.12 47.24,39.37 | v51.82,45.72 51.82,45.97 | v94.61,34.29 94.74,34.54 | v81.28,45.21 81.03,45.21 | v87.12,43.94 87.12,44.2 | 87.88,46.23 88.65,46.23 | v64.26,35.31 64.26,35.81
  other vias: 7.62,15.49 7.62,16.76 7.62,18.03 7.62,19.3 7.62,20.57 7.62,21.84 7.62,23.11 7.62,24.38 7.62,25.65 7.62,26.92 7.62,28.19 7.62,29.46 7.62,30.73 7.62,32 7.62,33.27 7.62,34.54 23.37,10.92 22.1,10.92 20.83,10.92 19.56,10.92 18.29,10.92 17.02,10.92 16.51,31.37 16.51,32.64 16.51,33.91 12.57,31.37 12.57,32.64 12.57,33.91 24.64,25.78 26.16,25.78 30.48,28.19 31.75,28.19 33.02,28.19 34.29,28.19 28.7,22.1 28.7,23.37 28.7,24.64 28.7,25.91 30.48,19.81 31.75,19.81 33.02,19.81 34.29,19.81 36.07,22.1 36.07,23.37 36.07,24.64 36.07,25.91 42.42,25.78 43.94,25.78 38.86,25.78 40.39,25.78 28.45,7.24 29.97,7.24 40.26,9.78 40.26,11.05 40.26,12.32 40.26,13.59 43.31,9.78 43.31,11.05 43.31,12.32 43.31,13.59 49.91,9.53 49.91,10.79 49.91,12.06 49.91,13.34 52.96,9.53 52.96,10.79 52.96,12.06 52.96,13.34 32.38,12.57 32.38,11.56 32.38,10.54 74.68,11.81 74.68,13.08 74.68,14.35 74.68,15.62 77.72,11.81 77.72,13.08 77.72,14.35 77.72,15.62
  pour Bottom (isolate 0.406, rank 6): 0,5.08 0,66.04 arc-90 5.08,71.12 147.83,71.12 arc-90 152.91,66.04 152.91,5.08 arc-90 147.83,0 5.08,0 arc-90
INTVCC  (1 unrouted)
INTVCC1  (1 unrouted)
LCD_RX  (1 unrouted)
  Top 0.254: 31.5,52.58 60.45,23.62 71.88,23.62 74.93,26.67 74.93,29.72 77.36,32.14 U1.42
LCD_TX  (1 unrouted)
LTC2986_INTERRUPT  (2 unrouted)
  Top 0.254: U1.13 92.1,31.34 92.2,31.24 94.79,31.24 95.5,30.52 95.5,26.42 98.55,23.37 111.51,23.37 118.87,30.73 125.22,30.73 127,32.51
N$1  (1 unrouted)
N$2  (1 unrouted)
N$3  (2 unrouted)
N$4  (1 unrouted)
N$5
  pour Top (isolate 0.305, no thermals): 11.68,26.92 11.68,15.49 14.99,12.19 26.42,12.19 27.69,13.46 28.96,13.46 28.96,16 24.89,16 22.61,18.29 22.61,26.92
N$6  (1 unrouted)
N$7  (1 unrouted)
N$8  (1 unrouted)
N$9  (1 unrouted)
N$12  (1 unrouted)
N$13  (15 unrouted)
N$14  (1 unrouted)
N$15  (1 unrouted)
P2
  Top 0.254: 29.72,53.59 60.2,23.11 72.14,23.11 75.44,26.42 75.44,29.46 77.32,31.34 U1.43
P3
  Top 0.254: 27.94,54.61 59.94,22.61 72.39,22.61 75.95,26.16 75.95,29.21 77.28,30.54 U1.44
P4
  Top 0.254: 26.16,55.63 60.71,21.08 75.95,21.08 80.58,25.72 U1.1
P5
  Top 0.254: 22.35,58.67 60.45,20.57 76.2,20.57 81.38,25.76 U1.2
P6
  Top 0.254: 20.57,58.93 59.44,20.07 76.45,20.07 82.18,25.79 U1.3
P13
  Top 0.254: U1.14 92.06,32.14 92.46,31.75 94.93,31.75 96.01,30.67 96.01,26.67 98.81,23.88 111.25,23.88 118.62,31.24 124.21,31.24 125.73,32.77
P14
  Top 0.254: 107.06,26.29 105.92,25.15 98.81,25.15 96.52,27.43 96.52,30.78 95.04,32.26 92.71,32.26 92.02,32.94 U1.15
P15
  Top 0.254: 104.52,26.8 103.38,25.65 99.06,25.65 97.03,27.69 97.03,30.97 95.23,32.77 92.96,32.77 91.99,33.74 U1.16
P16
  Top 0.254: 103.25,26.8 102.62,26.16 99.31,26.16 97.54,27.94 97.54,34.08 94.92,36.69 92.57,36.69 92.02,36.14 U1.19
P19
  Top 0.254: 84.44,55.26 84.84,54.86 89.66,54.86 91.95,52.58 91.95,38.86 91.63,38.54 U1.22
P20
  Top 0.254: 76.06,55.26 76.96,54.36 89.41,54.36 91.44,52.32 91.44,44.96 88.58,42.1 U1.23
P21
  Top 0.254: 67.93,56.02 70.1,53.85 89.15,53.85 90.93,52.07 90.93,45.21 87.78,42.06 U1.24
P22
  Top 0.254: U1.25 86.98,42.02 90.42,45.47 90.42,51.82 88.9,53.34 78.99,53.34 73.91,48.26 61.21,48.26 60.58,48.9
P23
  Top 0.254: U1.26 86.18,41.99 89.92,45.72 89.92,51.56 88.65,52.83 79.25,52.83 74.17,47.75 60.2,47.75 59.94,47.5 58.93,47.5 58.67,47.75 53.59,47.75 53.21,48.13 52.7,48.64
P24
  Top 0.254: U1.31 82.18,41.52 76.45,47.24 60.45,47.24 60.2,46.99 58.67,46.99 58.42,47.24 46.35,47.24 44.83,48.77
P25
  Top 0.254: U1.32 81.38,41.55 76.2,46.74 60.71,46.74 60.45,46.48 58.42,46.48 58.17,46.74 38.86,46.74 36.96,48.64
P26  (via drill 0.5)
  Top 0.254: v38.35,49.02 38.23,49.15 | 46.1,49.15 v46.23,49.02 | 53.98,49.15 v54.1,49.02 | 61.85,49.15 v61.98,49.02 | U1.33 80.58,41.34 75.95,45.97 v73.15,45.97
  Bottom 0.254: v38.35,49.02 v46.23,49.02 v54.1,49.02 v61.98,49.02 70.1,49.02 v73.15,45.97
P27  (via drill 0.5)
  Top 0.254: v35.56,52.32 35.69,52.2 | 43.56,48.39 v43.69,48.26 | 51.44,48.39 v51.56,48.26 | 59.31,48.39 v59.44,48.26 | U1.34 77.03,38.54 76.45,39.12 76.45,43.94 75.44,44.96 73.15,44.96 v72.14,45.97
  Bottom 0.254: v35.56,52.32 35.69,52.2 35.69,50.62 38.05,48.26 v43.69,48.26 v51.56,48.26 v59.44,48.26 69.85,48.26 71.37,46.74 v72.14,45.97
PROP_RES  (1 unrouted)
  Top 0.254: U1.7 85.38,23.58 85.6,23.37 R1.1
RT  (1 unrouted)
RT1  (1 unrouted)
RX_PROP
  Top 0.254: TAG_CONNECT.P$4 58.67,31.5 58.17,30.99 58.17,28.19 58.93,27.43 61.21,27.43 FTDI_CABLE.4 70.36,32.77 73.41,35.81 76.96,35.81 77.43,35.34 U1.38
SCL
  Top 0.254: U1.35 72.24,37.74 69.98,40.01 U2.6 52.96,40.01 51.82,38.86
SDA
  Top 0.254: U1.36 71.77,36.94 69.34,39.37 65.02,39.37 64.39,38.73 U2.5 54.23,38.73 53.85,38.35
SPI_LEVEL_SHIFTER_OE  (2 unrouted)
  Top 0.254: U1.12 94.68,30.54 95,30.23 95,26.16 98.3,22.86 111.76,22.86 115.32,26.42 117.86,26.42 118.11,26.67
SW  (5 unrouted)
SW1  (5 unrouted)
TR/SS  (1 unrouted)
TR/SS1  (1 unrouted)
TX_PROP
  Top 0.254: TAG_CONNECT.P$3 62.74,31.5 FTDI_CABLE.5 72.14,35.31 73.15,36.32 77.22,36.32 77.39,36.14 U1.37
VIN  (4 unrouted)
X0  (1 unrouted)
  Top 0.254: U1.29 83.78,46.52 arc90 82.55,47.75 81.1,47.75
X1  (1 unrouted)
  Top 0.254: U1.28 84.58,48.9 arc-90 85.98,50.29 87.3,50.29